# EAGLE schematic FresqueRVB (EAGLE 6.1)
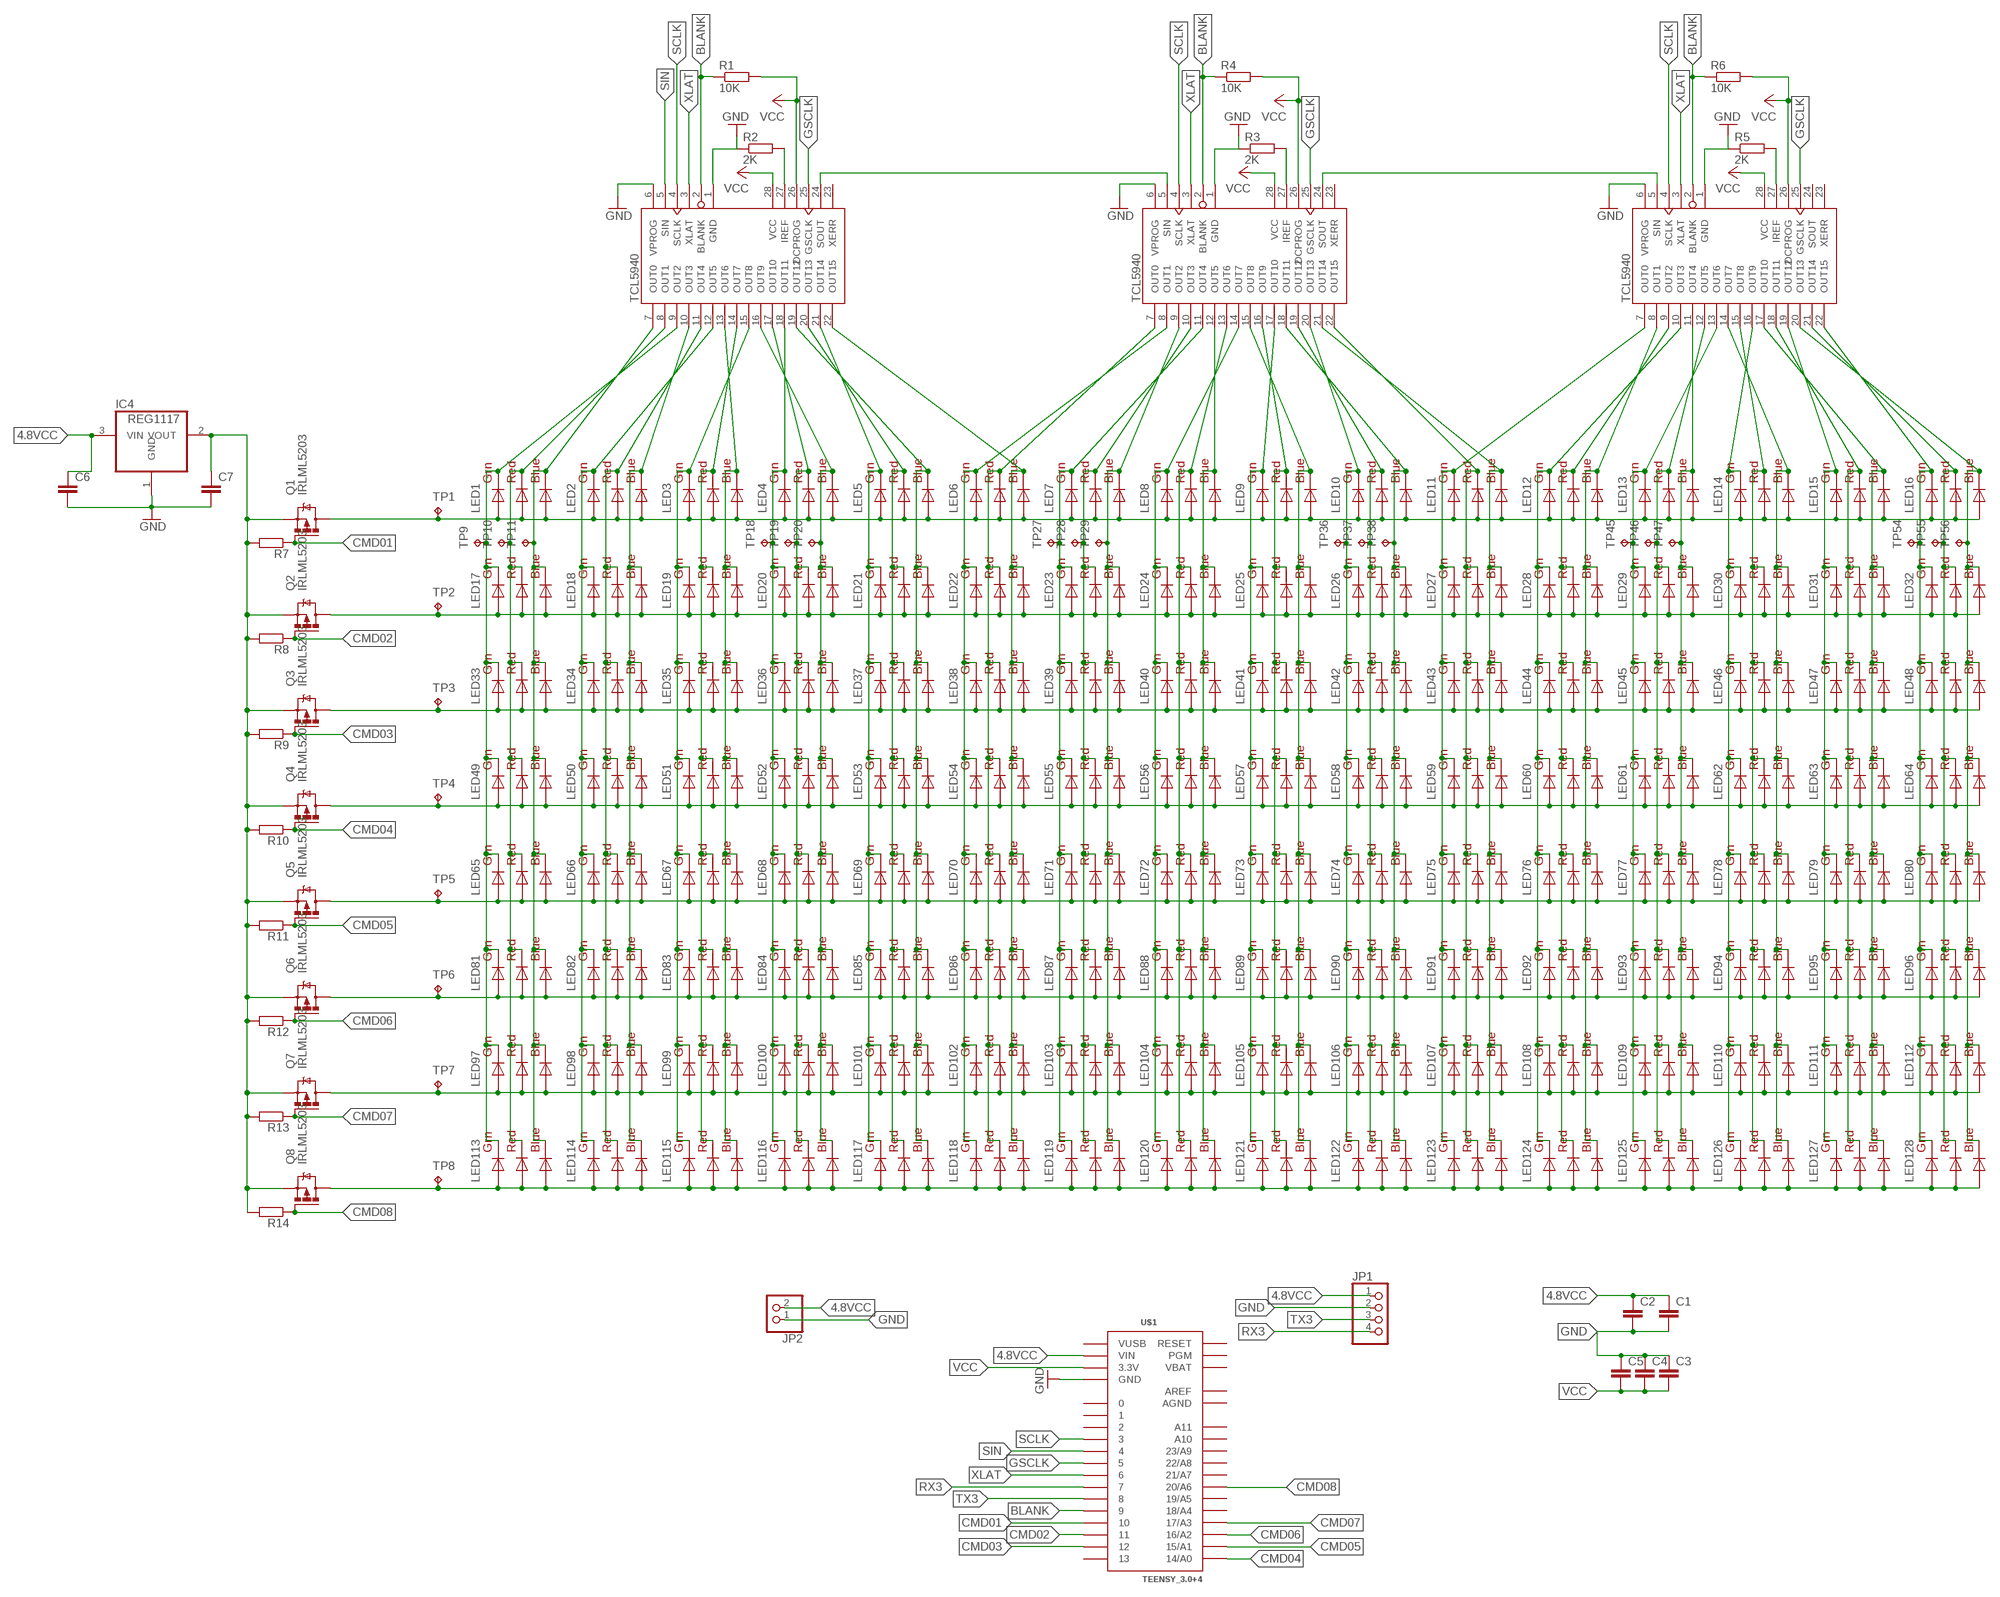
[diagram p0: schematic, sheet 1]

## Parts
C1  C-EUC0603K  [C0603K]
C2  C-EUC0603K  [C0603K]
C3  C-EUC0603K  [C0603K]
C4  C-EUC0603K  [C0603K]
C5  C-EUC0603K  [C0603K]
C6  C-EUC0603K  [C0603K]
C7  C-EUC0603K  [C0603K]
IC1  TCL5940_TCL5940PWP  [TCL5940_PWP]
IC2  TCL5940_TCL5940PWP  [TCL5940_PWP]
IC3  TCL5940_TCL5940PWP  [TCL5940_PWP]
IC4  REG1117  [SOT223]
JP1  PINHD-1X4  [1X04]
JP2  PINHD-1X2  [1X02]
LED1  RGBLED5050  [RGBLED5050]
LED2  RGBLED5050  [RGBLED5050]
LED3  RGBLED5050  [RGBLED5050]
LED4  RGBLED5050  [RGBLED5050]
LED5  RGBLED5050  [RGBLED5050]
LED6  RGBLED5050  [RGBLED5050]
LED7  RGBLED5050  [RGBLED5050]
LED8  RGBLED5050  [RGBLED5050]
LED9  RGBLED5050  [RGBLED5050]
LED10  RGBLED5050  [RGBLED5050]
LED11  RGBLED5050  [RGBLED5050]
LED12  RGBLED5050  [RGBLED5050]
LED13  RGBLED5050  [RGBLED5050]
LED14  RGBLED5050  [RGBLED5050]
LED15  RGBLED5050  [RGBLED5050]
LED16  RGBLED5050  [RGBLED5050]
LED17  RGBLED5050  [RGBLED5050]
LED18  RGBLED5050  [RGBLED5050]
LED19  RGBLED5050  [RGBLED5050]
LED20  RGBLED5050  [RGBLED5050]
LED21  RGBLED5050  [RGBLED5050]
LED22  RGBLED5050  [RGBLED5050]
LED23  RGBLED5050  [RGBLED5050]
LED24  RGBLED5050  [RGBLED5050]
LED25  RGBLED5050  [RGBLED5050]
LED26  RGBLED5050  [RGBLED5050]
LED27  RGBLED5050  [RGBLED5050]
LED28  RGBLED5050  [RGBLED5050]
LED29  RGBLED5050  [RGBLED5050]
LED30  RGBLED5050  [RGBLED5050]
LED31  RGBLED5050  [RGBLED5050]
LED32  RGBLED5050  [RGBLED5050]
LED33  RGBLED5050  [RGBLED5050]
LED34  RGBLED5050  [RGBLED5050]
LED35  RGBLED5050  [RGBLED5050]
LED36  RGBLED5050  [RGBLED5050]
LED37  RGBLED5050  [RGBLED5050]
LED38  RGBLED5050  [RGBLED5050]
LED39  RGBLED5050  [RGBLED5050]
LED40  RGBLED5050  [RGBLED5050]
LED41  RGBLED5050  [RGBLED5050]
LED42  RGBLED5050  [RGBLED5050]
LED43  RGBLED5050  [RGBLED5050]
LED44  RGBLED5050  [RGBLED5050]
LED45  RGBLED5050  [RGBLED5050]
LED46  RGBLED5050  [RGBLED5050]
LED47  RGBLED5050  [RGBLED5050]
LED48  RGBLED5050  [RGBLED5050]
LED49  RGBLED5050  [RGBLED5050]
LED50  RGBLED5050  [RGBLED5050]
LED51  RGBLED5050  [RGBLED5050]
LED52  RGBLED5050  [RGBLED5050]
LED53  RGBLED5050  [RGBLED5050]
LED54  RGBLED5050  [RGBLED5050]
LED55  RGBLED5050  [RGBLED5050]
LED56  RGBLED5050  [RGBLED5050]
LED57  RGBLED5050  [RGBLED5050]
LED58  RGBLED5050  [RGBLED5050]
LED59  RGBLED5050  [RGBLED5050]
LED60  RGBLED5050  [RGBLED5050]
LED61  RGBLED5050  [RGBLED5050]
LED62  RGBLED5050  [RGBLED5050]
LED63  RGBLED5050  [RGBLED5050]
LED64  RGBLED5050  [RGBLED5050]
LED65  RGBLED5050  [RGBLED5050]
LED66  RGBLED5050  [RGBLED5050]
LED67  RGBLED5050  [RGBLED5050]
LED68  RGBLED5050  [RGBLED5050]
LED69  RGBLED5050  [RGBLED5050]
LED70  RGBLED5050  [RGBLED5050]
LED71  RGBLED5050  [RGBLED5050]
LED72  RGBLED5050  [RGBLED5050]
LED73  RGBLED5050  [RGBLED5050]
LED74  RGBLED5050  [RGBLED5050]
LED75  RGBLED5050  [RGBLED5050]
LED76  RGBLED5050  [RGBLED5050]
LED77  RGBLED5050  [RGBLED5050]
LED78  RGBLED5050  [RGBLED5050]
LED79  RGBLED5050  [RGBLED5050]
LED80  RGBLED5050  [RGBLED5050]
LED81  RGBLED5050  [RGBLED5050]
LED82  RGBLED5050  [RGBLED5050]
LED83  RGBLED5050  [RGBLED5050]
LED84  RGBLED5050  [RGBLED5050]
LED85  RGBLED5050  [RGBLED5050]
LED86  RGBLED5050  [RGBLED5050]
LED87  RGBLED5050  [RGBLED5050]
LED88  RGBLED5050  [RGBLED5050]
LED89  RGBLED5050  [RGBLED5050]
LED90  RGBLED5050  [RGBLED5050]
LED91  RGBLED5050  [RGBLED5050]
LED92  RGBLED5050  [RGBLED5050]
LED93  RGBLED5050  [RGBLED5050]
LED94  RGBLED5050  [RGBLED5050]
LED95  RGBLED5050  [RGBLED5050]
LED96  RGBLED5050  [RGBLED5050]
LED97  RGBLED5050  [RGBLED5050]
LED98  RGBLED5050  [RGBLED5050]
LED99  RGBLED5050  [RGBLED5050]
LED100  RGBLED5050  [RGBLED5050]
LED101  RGBLED5050  [RGBLED5050]
LED102  RGBLED5050  [RGBLED5050]
LED103  RGBLED5050  [RGBLED5050]
LED104  RGBLED5050  [RGBLED5050]
LED105  RGBLED5050  [RGBLED5050]
LED106  RGBLED5050  [RGBLED5050]
LED107  RGBLED5050  [RGBLED5050]
LED108  RGBLED5050  [RGBLED5050]
LED109  RGBLED5050  [RGBLED5050]
LED110  RGBLED5050  [RGBLED5050]
LED111  RGBLED5050  [RGBLED5050]
LED112  RGBLED5050  [RGBLED5050]
LED113  RGBLED5050  [RGBLED5050]
LED114  RGBLED5050  [RGBLED5050]
LED115  RGBLED5050  [RGBLED5050]
LED116  RGBLED5050  [RGBLED5050]
LED117  RGBLED5050  [RGBLED5050]
LED118  RGBLED5050  [RGBLED5050]
LED119  RGBLED5050  [RGBLED5050]
LED120  RGBLED5050  [RGBLED5050]
LED121  RGBLED5050  [RGBLED5050]
LED122  RGBLED5050  [RGBLED5050]
LED123  RGBLED5050  [RGBLED5050]
LED124  RGBLED5050  [RGBLED5050]
LED125  RGBLED5050  [RGBLED5050]
LED126  RGBLED5050  [RGBLED5050]
LED127  RGBLED5050  [RGBLED5050]
LED128  RGBLED5050  [RGBLED5050]
Q1  IRLML5203  [MICRO3]
Q2  IRLML5203  [MICRO3]
Q3  IRLML5203  [MICRO3]
Q4  IRLML5203  [MICRO3]
Q5  IRLML5203  [MICRO3]
Q6  IRLML5203  [MICRO3]
Q7  IRLML5203  [MICRO3]
Q8  IRLML5203  [MICRO3]
R1  10K  R-EU_R0603  [R0603]
R2  2K  R-EU_R0603  [R0603]
R3  2K  R-EU_R0603  [R0603]
R4  10K  R-EU_R0603  [R0603]
R5  2K  R-EU_R0603  [R0603]
R6  10K  R-EU_R0603  [R0603]
R7  R-EU_R0603  [R0603]
R8  R-EU_R0603  [R0603]
R9  R-EU_R0603  [R0603]
R10  R-EU_R0603  [R0603]
R11  R-EU_R0603  [R0603]
R12  R-EU_R0603  [R0603]
R13  R-EU_R0603  [R0603]
R14  R-EU_R0603  [R0603]
TP1  TPPAD1-13  [P1-13]
TP2  TPPAD1-13  [P1-13]
TP3  TPPAD1-13  [P1-13]
TP4  TPPAD1-13  [P1-13]
TP5  TPPAD1-13  [P1-13]
TP6  TPPAD1-13  [P1-13]
TP7  TPPAD1-13  [P1-13]
TP8  TPPAD1-13  [P1-13]
TP9  TPPAD1-13  [P1-13]
TP10  TPPAD1-13  [P1-13]
TP11  TPPAD1-13  [P1-13]
TP18  TPPAD1-13  [P1-13]
TP19  TPPAD1-13  [P1-13]
TP20  TPPAD1-13  [P1-13]
TP27  TPPAD1-13  [P1-13]
TP28  TPPAD1-13  [P1-13]
TP29  TPPAD1-13  [P1-13]
TP36  TPPAD1-13  [P1-13]
TP37  TPPAD1-13  [P1-13]
TP38  TPPAD1-13  [P1-13]
TP45  TPPAD1-13  [P1-13]
TP46  TPPAD1-13  [P1-13]
TP47  TPPAD1-13  [P1-13]
TP54  TPPAD1-13  [P1-13]
TP55  TPPAD1-13  [P1-13]
TP56  TPPAD1-13  [P1-13]
U$1  TEENSY_3.0+4  [TEENSY_3.0+4]

## Nets
4.8VCC: C1.1 C2.1 C6.1 IC4.3(VIN) JP1.1 JP2.2 U$1.VIN
BLANK: IC1.2(BLANK) IC2.2(BLANK) IC3.2(BLANK) R1.1 R4.1 R6.1 U$1.9
CMD01: Q1.1(G) R7.1 U$1.10
CMD02: Q2.1(G) R8.1 U$1.11
CMD03: Q3.1(G) R9.1 U$1.12
CMD04: Q4.1(G) R10.1 U$1.14/A0
CMD05: Q5.1(G) R11.1 U$1.15/A1
CMD06: Q6.1(G) R12.1 U$1.16/A2
CMD07: Q7.1(G) R13.1 U$1.17/A3
CMD08: Q8.1(G) R14.1 U$1.20/A6
GND: C1.2 C2.2 C3.1 C4.1 C5.1 C6.2 C7.2 IC1.1(GND) IC1.6(VPROG) IC2.6(VPROG) IC3.1(GND) IC3.6(VPROG) IC4.1(GND) JP1.2 JP2.1 R2.1 R3.1 R5.1 U$1.GND U$1.GND1(GND)
GSCLK: IC1.25(GSCLK) IC2.25(GSCLK) IC3.25(GSCLK) U$1.5
N$1: IC2.27(IREF) R3.2
N$2: IC1.27(IREF) R2.2
N$3: IC3.27(IREF) R5.2
N$4: IC1.9(OUT2) LED1.6(GREEN_C) LED17.6(GREEN_C) LED33.6(GREEN_C) LED49.6(GREEN_C) LED65.6(GREEN_C) LED81.6(GREEN_C) LED97.6(GREEN_C) LED113.6(GREEN_C) TP9.TP
N$5: IC1.8(OUT1) LED1.5(RED_C) LED17.5(RED_C) LED33.5(RED_C) LED49.5(RED_C) LED65.5(RED_C) LED81.5(RED_C) LED97.5(RED_C) LED113.5(RED_C) TP10.TP
N$6: IC1.7(OUT0) LED1.4(BLUE_C) LED17.4(BLUE_C) LED33.4(BLUE_C) LED49.4(BLUE_C) LED65.4(BLUE_C) LED81.4(BLUE_C) LED97.4(BLUE_C) LED113.4(BLUE_C) TP11.TP
N$7: IC1.12(OUT5) LED2.6(GREEN_C) LED18.6(GREEN_C) LED34.6(GREEN_C) LED50.6(GREEN_C) LED66.6(GREEN_C) LED82.6(GREEN_C) LED98.6(GREEN_C) LED114.6(GREEN_C)
N$8: IC1.11(OUT4) LED2.5(RED_C) LED18.5(RED_C) LED34.5(RED_C) LED50.5(RED_C) LED66.5(RED_C) LED82.5(RED_C) LED98.5(RED_C) LED114.5(RED_C)
N$9: IC1.10(OUT3) LED2.4(BLUE_C) LED18.4(BLUE_C) LED34.4(BLUE_C) LED50.4(BLUE_C) LED66.4(BLUE_C) LED82.4(BLUE_C) LED98.4(BLUE_C) LED114.4(BLUE_C)
N$10: IC1.15(OUT8) LED3.6(GREEN_C) LED19.6(GREEN_C) LED35.6(GREEN_C) LED51.6(GREEN_C) LED67.6(GREEN_C) LED83.6(GREEN_C) LED99.6(GREEN_C) LED115.6(GREEN_C)
N$11: IC1.14(OUT7) LED3.5(RED_C) LED19.5(RED_C) LED35.5(RED_C) LED51.5(RED_C) LED67.5(RED_C) LED83.5(RED_C) LED99.5(RED_C) LED115.5(RED_C)
N$12: IC1.13(OUT6) LED3.4(BLUE_C) LED19.4(BLUE_C) LED35.4(BLUE_C) LED51.4(BLUE_C) LED67.4(BLUE_C) LED83.4(BLUE_C) LED99.4(BLUE_C) LED115.4(BLUE_C)
N$13: IC1.18(OUT11) LED4.6(GREEN_C) LED20.6(GREEN_C) LED36.6(GREEN_C) LED52.6(GREEN_C) LED68.6(GREEN_C) LED84.6(GREEN_C) LED100.6(GREEN_C) LED116.6(GREEN_C) TP18.TP
N$14: IC1.17(OUT10) LED4.5(RED_C) LED20.5(RED_C) LED36.5(RED_C) LED52.5(RED_C) LED68.5(RED_C) LED84.5(RED_C) LED100.5(RED_C) LED116.5(RED_C) TP19.TP
N$15: IC1.16(OUT9) LED4.4(BLUE_C) LED20.4(BLUE_C) LED36.4(BLUE_C) LED52.4(BLUE_C) LED68.4(BLUE_C) LED84.4(BLUE_C) LED100.4(BLUE_C) LED116.4(BLUE_C) TP20.TP
N$16: IC1.21(OUT14) LED5.6(GREEN_C) LED21.6(GREEN_C) LED37.6(GREEN_C) LED53.6(GREEN_C) LED69.6(GREEN_C) LED85.6(GREEN_C) LED101.6(GREEN_C) LED117.6(GREEN_C)
N$17: IC1.20(OUT13) LED5.5(RED_C) LED21.5(RED_C) LED37.5(RED_C) LED53.5(RED_C) LED69.5(RED_C) LED85.5(RED_C) LED101.5(RED_C) LED117.5(RED_C)
N$18: IC1.19(OUT12) LED5.4(BLUE_C) LED21.4(BLUE_C) LED37.4(BLUE_C) LED53.4(BLUE_C) LED69.4(BLUE_C) LED85.4(BLUE_C) LED101.4(BLUE_C) LED117.4(BLUE_C)
N$19: IC2.8(OUT1) LED6.6(GREEN_C) LED22.6(GREEN_C) LED38.6(GREEN_C) LED54.6(GREEN_C) LED70.6(GREEN_C) LED86.6(GREEN_C) LED102.6(GREEN_C) LED118.6(GREEN_C)
N$20: IC2.7(OUT0) LED6.5(RED_C) LED22.5(RED_C) LED38.5(RED_C) LED54.5(RED_C) LED70.5(RED_C) LED86.5(RED_C) LED102.5(RED_C) LED118.5(RED_C)
N$21: IC1.22(OUT15) LED6.4(BLUE_C) LED22.4(BLUE_C) LED38.4(BLUE_C) LED54.4(BLUE_C) LED70.4(BLUE_C) LED86.4(BLUE_C) LED102.4(BLUE_C) LED118.4(BLUE_C)
N$22: IC2.11(OUT4) LED7.6(GREEN_C) LED23.6(GREEN_C) LED39.6(GREEN_C) LED55.6(GREEN_C) LED71.6(GREEN_C) LED87.6(GREEN_C) LED103.6(GREEN_C) LED119.6(GREEN_C) TP27.TP
N$23: IC2.10(OUT3) LED7.5(RED_C) LED23.5(RED_C) LED39.5(RED_C) LED55.5(RED_C) LED71.5(RED_C) LED87.5(RED_C) LED103.5(RED_C) LED119.5(RED_C) TP28.TP
N$24: IC2.9(OUT2) LED7.4(BLUE_C) LED23.4(BLUE_C) LED39.4(BLUE_C) LED55.4(BLUE_C) LED71.4(BLUE_C) LED87.4(BLUE_C) LED103.4(BLUE_C) LED119.4(BLUE_C) TP29.TP
N$25: IC2.14(OUT7) LED8.6(GREEN_C) LED24.6(GREEN_C) LED40.6(GREEN_C) LED56.6(GREEN_C) LED72.6(GREEN_C) LED88.6(GREEN_C) LED104.6(GREEN_C) LED120.6(GREEN_C)
N$26: IC2.13(OUT6) LED8.5(RED_C) LED24.5(RED_C) LED40.5(RED_C) LED56.5(RED_C) LED72.5(RED_C) LED88.5(RED_C) LED104.5(RED_C) LED120.5(RED_C)
N$27: IC2.12(OUT5) LED8.4(BLUE_C) LED24.4(BLUE_C) LED40.4(BLUE_C) LED56.4(BLUE_C) LED72.4(BLUE_C) LED88.4(BLUE_C) LED104.4(BLUE_C) LED120.4(BLUE_C)
N$28: IC2.17(OUT10) LED9.6(GREEN_C) LED25.6(GREEN_C) LED41.6(GREEN_C) LED57.6(GREEN_C) LED73.6(GREEN_C) LED89.6(GREEN_C) LED105.6(GREEN_C) LED121.6(GREEN_C)
N$29: IC2.16(OUT9) LED9.5(RED_C) LED25.5(RED_C) LED41.5(RED_C) LED57.5(RED_C) LED73.5(RED_C) LED89.5(RED_C) LED105.5(RED_C) LED121.5(RED_C)
N$30: IC2.15(OUT8) LED9.4(BLUE_C) LED25.4(BLUE_C) LED41.4(BLUE_C) LED57.4(BLUE_C) LED73.4(BLUE_C) LED89.4(BLUE_C) LED105.4(BLUE_C) LED121.4(BLUE_C)
N$31: IC2.20(OUT13) LED10.6(GREEN_C) LED26.6(GREEN_C) LED42.6(GREEN_C) LED58.6(GREEN_C) LED74.6(GREEN_C) LED90.6(GREEN_C) LED106.6(GREEN_C) LED122.6(GREEN_C) TP36.TP
N$32: IC2.19(OUT12) LED10.5(RED_C) LED26.5(RED_C) LED42.5(RED_C) LED58.5(RED_C) LED74.5(RED_C) LED90.5(RED_C) LED106.5(RED_C) LED122.5(RED_C) TP37.TP
N$33: IC2.18(OUT11) LED10.4(BLUE_C) LED26.4(BLUE_C) LED42.4(BLUE_C) LED58.4(BLUE_C) LED74.4(BLUE_C) LED90.4(BLUE_C) LED106.4(BLUE_C) LED122.4(BLUE_C) TP38.TP
N$34: IC3.7(OUT0) LED11.6(GREEN_C) LED27.6(GREEN_C) LED43.6(GREEN_C) LED59.6(GREEN_C) LED75.6(GREEN_C) LED91.6(GREEN_C) LED107.6(GREEN_C) LED123.6(GREEN_C)
N$35: IC2.22(OUT15) LED11.5(RED_C) LED27.5(RED_C) LED43.5(RED_C) LED59.5(RED_C) LED75.5(RED_C) LED91.5(RED_C) LED107.5(RED_C) LED123.5(RED_C)
N$36: IC2.21(OUT14) LED11.4(BLUE_C) LED27.4(BLUE_C) LED43.4(BLUE_C) LED59.4(BLUE_C) LED75.4(BLUE_C) LED91.4(BLUE_C) LED107.4(BLUE_C) LED123.4(BLUE_C)
N$37: IC3.10(OUT3) LED12.6(GREEN_C) LED28.6(GREEN_C) LED44.6(GREEN_C) LED60.6(GREEN_C) LED76.6(GREEN_C) LED92.6(GREEN_C) LED108.6(GREEN_C) LED124.6(GREEN_C)
N$38: IC3.9(OUT2) LED12.5(RED_C) LED28.5(RED_C) LED44.5(RED_C) LED60.5(RED_C) LED76.5(RED_C) LED92.5(RED_C) LED108.5(RED_C) LED124.5(RED_C)
N$39: IC3.8(OUT1) LED12.4(BLUE_C) LED28.4(BLUE_C) LED44.4(BLUE_C) LED60.4(BLUE_C) LED76.4(BLUE_C) LED92.4(BLUE_C) LED108.4(BLUE_C) LED124.4(BLUE_C)
N$40: IC3.13(OUT6) LED13.6(GREEN_C) LED29.6(GREEN_C) LED45.6(GREEN_C) LED61.6(GREEN_C) LED77.6(GREEN_C) LED93.6(GREEN_C) LED109.6(GREEN_C) LED125.6(GREEN_C) TP45.TP
N$41: IC3.12(OUT5) LED13.5(RED_C) LED29.5(RED_C) LED45.5(RED_C) LED61.5(RED_C) LED77.5(RED_C) LED93.5(RED_C) LED109.5(RED_C) LED125.5(RED_C) TP46.TP
N$42: IC3.11(OUT4) LED13.4(BLUE_C) LED29.4(BLUE_C) LED45.4(BLUE_C) LED61.4(BLUE_C) LED77.4(BLUE_C) LED93.4(BLUE_C) LED109.4(BLUE_C) LED125.4(BLUE_C) TP47.TP
N$43: IC3.16(OUT9) LED14.6(GREEN_C) LED30.6(GREEN_C) LED46.6(GREEN_C) LED62.6(GREEN_C) LED78.6(GREEN_C) LED94.6(GREEN_C) LED110.6(GREEN_C) LED126.6(GREEN_C)
N$44: IC3.15(OUT8) LED14.5(RED_C) LED30.5(RED_C) LED46.5(RED_C) LED62.5(RED_C) LED78.5(RED_C) LED94.5(RED_C) LED110.5(RED_C) LED126.5(RED_C)
N$45: IC3.14(OUT7) LED14.4(BLUE_C) LED30.4(BLUE_C) LED46.4(BLUE_C) LED62.4(BLUE_C) LED78.4(BLUE_C) LED94.4(BLUE_C) LED110.4(BLUE_C) LED126.4(BLUE_C)
N$46: IC3.19(OUT12) LED15.6(GREEN_C) LED31.6(GREEN_C) LED47.6(GREEN_C) LED63.6(GREEN_C) LED79.6(GREEN_C) LED95.6(GREEN_C) LED111.6(GREEN_C) LED127.6(GREEN_C)
N$47: IC3.18(OUT11) LED15.5(RED_C) LED31.5(RED_C) LED47.5(RED_C) LED63.5(RED_C) LED79.5(RED_C) LED95.5(RED_C) LED111.5(RED_C) LED127.5(RED_C)
N$48: IC3.17(OUT10) LED15.4(BLUE_C) LED31.4(BLUE_C) LED47.4(BLUE_C) LED63.4(BLUE_C) LED79.4(BLUE_C) LED95.4(BLUE_C) LED111.4(BLUE_C) LED127.4(BLUE_C)
N$49: IC3.22(OUT15) LED16.6(GREEN_C) LED32.6(GREEN_C) LED48.6(GREEN_C) LED64.6(GREEN_C) LED80.6(GREEN_C) LED96.6(GREEN_C) LED112.6(GREEN_C) LED128.6(GREEN_C) TP54.TP
N$50: IC3.21(OUT14) LED16.5(RED_C) LED32.5(RED_C) LED48.5(RED_C) LED64.5(RED_C) LED80.5(RED_C) LED96.5(RED_C) LED112.5(RED_C) LED128.5(RED_C) TP55.TP
N$51: IC3.20(OUT13) LED16.4(BLUE_C) LED32.4(BLUE_C) LED48.4(BLUE_C) LED64.4(BLUE_C) LED80.4(BLUE_C) LED96.4(BLUE_C) LED112.4(BLUE_C) LED128.4(BLUE_C) TP56.TP
N$52: IC1.24(SOUT) IC2.5(SIN)
N$53: IC2.24(SOUT) IC3.5(SIN)
N$54: LED1.1(GREEN_A) LED1.2(RED_A) LED1.3(BLUE_A) LED2.1(GREEN_A) LED2.2(RED_A) LED2.3(BLUE_A) LED3.1(GREEN_A) LED3.2(RED_A) LED3.3(BLUE_A) LED4.1(GREEN_A) LED4.2(RED_A) LED4.3(BLUE_A) LED5.1(GREEN_A) LED5.2(RED_A) LED5.3(BLUE_A) LED6.1(GREEN_A) LED6.2(RED_A) LED6.3(BLUE_A) LED7.1(GREEN_A) LED7.2(RED_A) LED7.3(BLUE_A) LED8.1(GREEN_A) LED8.2(RED_A) LED8.3(BLUE_A) LED9.1(GREEN_A) LED9.2(RED_A) LED9.3(BLUE_A) LED10.1(GREEN_A) LED10.2(RED_A) LED10.3(BLUE_A) LED11.1(GREEN_A) LED11.2(RED_A) LED11.3(BLUE_A) LED12.1(GREEN_A) LED12.2(RED_A) LED12.3(BLUE_A) LED13.1(GREEN_A) LED13.2(RED_A) LED13.3(BLUE_A) LED14.1(GREEN_A) LED14.2(RED_A) LED14.3(BLUE_A) LED15.1(GREEN_A) LED15.2(RED_A) LED15.3(BLUE_A) LED16.1(GREEN_A) LED16.2(RED_A) LED16.3(BLUE_A) Q1.3(D) TP1.TP
N$55: LED17.1(GREEN_A) LED17.2(RED_A) LED17.3(BLUE_A) LED18.1(GREEN_A) LED18.2(RED_A) LED18.3(BLUE_A) LED19.1(GREEN_A) LED19.2(RED_A) LED19.3(BLUE_A) LED20.1(GREEN_A) LED20.2(RED_A) LED20.3(BLUE_A) LED21.1(GREEN_A) LED21.2(RED_A) LED21.3(BLUE_A) LED22.1(GREEN_A) LED22.2(RED_A) LED22.3(BLUE_A) LED23.1(GREEN_A) LED23.2(RED_A) LED23.3(BLUE_A) LED24.1(GREEN_A) LED24.2(RED_A) LED24.3(BLUE_A) LED25.1(GREEN_A) LED25.2(RED_A) LED25.3(BLUE_A) LED26.1(GREEN_A) LED26.2(RED_A) LED26.3(BLUE_A) LED27.1(GREEN_A) LED27.2(RED_A) LED27.3(BLUE_A) LED28.1(GREEN_A) LED28.2(RED_A) LED28.3(BLUE_A) LED29.1(GREEN_A) LED29.2(RED_A) LED29.3(BLUE_A) LED30.1(GREEN_A) LED30.2(RED_A) LED30.3(BLUE_A) LED31.1(GREEN_A) LED31.2(RED_A) LED31.3(BLUE_A) LED32.1(GREEN_A) LED32.2(RED_A) LED32.3(BLUE_A) Q2.3(D) TP2.TP
N$63: C7.1 IC4.2(VOUT) Q1.2(S) Q2.2(S) Q3.2(S) Q4.2(S) Q5.2(S) Q6.2(S) Q7.2(S) Q8.2(S) R7.2 R8.2 R9.2 R10.2 R11.2 R12.2 R13.2 R14.2
N$104: LED33.1(GREEN_A) LED33.2(RED_A) LED33.3(BLUE_A) LED34.1(GREEN_A) LED34.2(RED_A) LED34.3(BLUE_A) LED35.1(GREEN_A) LED35.2(RED_A) LED35.3(BLUE_A) LED36.1(GREEN_A) LED36.2(RED_A) LED36.3(BLUE_A) LED37.1(GREEN_A) LED37.2(RED_A) LED37.3(BLUE_A) LED38.1(GREEN_A) LED38.2(RED_A) LED38.3(BLUE_A) LED39.1(GREEN_A) LED39.2(RED_A) LED39.3(BLUE_A) LED40.1(GREEN_A) LED40.2(RED_A) LED40.3(BLUE_A) LED41.1(GREEN_A) LED41.2(RED_A) LED41.3(BLUE_A) LED42.1(GREEN_A) LED42.2(RED_A) LED42.3(BLUE_A) LED43.1(GREEN_A) LED43.2(RED_A) LED43.3(BLUE_A) LED44.1(GREEN_A) LED44.2(RED_A) LED44.3(BLUE_A) LED45.1(GREEN_A) LED45.2(RED_A) LED45.3(BLUE_A) LED46.1(GREEN_A) LED46.2(RED_A) LED46.3(BLUE_A) LED47.1(GREEN_A) LED47.2(RED_A) LED47.3(BLUE_A) LED48.1(GREEN_A) LED48.2(RED_A) LED48.3(BLUE_A) Q3.3(D) TP3.TP
N$105: LED49.1(GREEN_A) LED49.2(RED_A) LED49.3(BLUE_A) LED50.1(GREEN_A) LED50.2(RED_A) LED50.3(BLUE_A) LED51.1(GREEN_A) LED51.2(RED_A) LED51.3(BLUE_A) LED52.1(GREEN_A) LED52.2(RED_A) LED52.3(BLUE_A) LED53.1(GREEN_A) LED53.2(RED_A) LED53.3(BLUE_A) LED54.1(GREEN_A) LED54.2(RED_A) LED54.3(BLUE_A) LED55.1(GREEN_A) LED55.2(RED_A) LED55.3(BLUE_A) LED56.1(GREEN_A) LED56.2(RED_A) LED56.3(BLUE_A) LED57.1(GREEN_A) LED57.2(RED_A) LED57.3(BLUE_A) LED58.1(GREEN_A) LED58.2(RED_A) LED58.3(BLUE_A) LED59.1(GREEN_A) LED59.2(RED_A) LED59.3(BLUE_A) LED60.1(GREEN_A) LED60.2(RED_A) LED60.3(BLUE_A) LED61.1(GREEN_A) LED61.2(RED_A) LED61.3(BLUE_A) LED62.1(GREEN_A) LED62.2(RED_A) LED62.3(BLUE_A) LED63.1(GREEN_A) LED63.2(RED_A) LED63.3(BLUE_A) LED64.1(GREEN_A) LED64.2(RED_A) LED64.3(BLUE_A) Q4.3(D) TP4.TP
N$154: LED65.1(GREEN_A) LED65.2(RED_A) LED65.3(BLUE_A) LED66.1(GREEN_A) LED66.2(RED_A) LED66.3(BLUE_A) LED67.1(GREEN_A) LED67.2(RED_A) LED67.3(BLUE_A) LED68.1(GREEN_A) LED68.2(RED_A) LED68.3(BLUE_A) LED69.1(GREEN_A) LED69.2(RED_A) LED69.3(BLUE_A) LED70.1(GREEN_A) LED70.2(RED_A) LED70.3(BLUE_A) LED71.1(GREEN_A) LED71.2(RED_A) LED71.3(BLUE_A) LED72.1(GREEN_A) LED72.2(RED_A) LED72.3(BLUE_A) LED73.1(GREEN_A) LED73.2(RED_A) LED73.3(BLUE_A) LED74.1(GREEN_A) LED74.2(RED_A) LED74.3(BLUE_A) LED75.1(GREEN_A) LED75.2(RED_A) LED75.3(BLUE_A) LED76.1(GREEN_A) LED76.2(RED_A) LED76.3(BLUE_A) LED77.1(GREEN_A) LED77.2(RED_A) LED77.3(BLUE_A) LED78.1(GREEN_A) LED78.2(RED_A) LED78.3(BLUE_A) LED79.1(GREEN_A) LED79.2(RED_A) LED79.3(BLUE_A) LED80.1(GREEN_A) LED80.2(RED_A) LED80.3(BLUE_A) Q5.3(D) TP5.TP
N$203: LED81.1(GREEN_A) LED81.2(RED_A) LED81.3(BLUE_A) LED82.1(GREEN_A) LED82.2(RED_A) LED82.3(BLUE_A) LED83.1(GREEN_A) LED83.2(RED_A) LED83.3(BLUE_A) LED84.1(GREEN_A) LED84.2(RED_A) LED84.3(BLUE_A) LED85.1(GREEN_A) LED85.2(RED_A) LED85.3(BLUE_A) LED86.1(GREEN_A) LED86.2(RED_A) LED86.3(BLUE_A) LED87.1(GREEN_A) LED87.2(RED_A) LED87.3(BLUE_A) LED88.1(GREEN_A) LED88.2(RED_A) LED88.3(BLUE_A) LED89.1(GREEN_A) LED89.2(RED_A) LED89.3(BLUE_A) LED90.1(GREEN_A) LED90.2(RED_A) LED90.3(BLUE_A) LED91.1(GREEN_A) LED91.2(RED_A) LED91.3(BLUE_A) LED92.1(GREEN_A) LED92.2(RED_A) LED92.3(BLUE_A) LED93.1(GREEN_A) LED93.2(RED_A) LED93.3(BLUE_A) LED94.1(GREEN_A) LED94.2(RED_A) LED94.3(BLUE_A) LED95.1(GREEN_A) LED95.2(RED_A) LED95.3(BLUE_A) LED96.1(GREEN_A) LED96.2(RED_A) LED96.3(BLUE_A) Q6.3(D) TP6.TP
N$252: LED97.1(GREEN_A) LED97.2(RED_A) LED97.3(BLUE_A) LED98.1(GREEN_A) LED98.2(RED_A) LED98.3(BLUE_A) LED99.1(GREEN_A) LED99.2(RED_A) LED99.3(BLUE_A) LED100.1(GREEN_A) LED100.2(RED_A) LED100.3(BLUE_A) LED101.1(GREEN_A) LED101.2(RED_A) LED101.3(BLUE_A) LED102.1(GREEN_A) LED102.2(RED_A) LED102.3(BLUE_A) LED103.1(GREEN_A) LED103.2(RED_A) LED103.3(BLUE_A) LED104.1(GREEN_A) LED104.2(RED_A) LED104.3(BLUE_A) LED105.1(GREEN_A) LED105.2(RED_A) LED105.3(BLUE_A) LED106.1(GREEN_A) LED106.2(RED_A) LED106.3(BLUE_A) LED107.1(GREEN_A) LED107.2(RED_A) LED107.3(BLUE_A) LED108.1(GREEN_A) LED108.2(RED_A) LED108.3(BLUE_A) LED109.1(GREEN_A) LED109.2(RED_A) LED109.3(BLUE_A) LED110.1(GREEN_A) LED110.2(RED_A) LED110.3(BLUE_A) LED111.1(GREEN_A) LED111.2(RED_A) LED111.3(BLUE_A) LED112.1(GREEN_A) LED112.2(RED_A) LED112.3(BLUE_A) Q7.3(D) TP7.TP
N$301: LED113.1(GREEN_A) LED113.2(RED_A) LED113.3(BLUE_A) LED114.1(GREEN_A) LED114.2(RED_A) LED114.3(BLUE_A) LED115.1(GREEN_A) LED115.2(RED_A) LED115.3(BLUE_A) LED116.1(GREEN_A) LED116.2(RED_A) LED116.3(BLUE_A) LED117.1(GREEN_A) LED117.2(RED_A) LED117.3(BLUE_A) LED118.1(GREEN_A) LED118.2(RED_A) LED118.3(BLUE_A) LED119.1(GREEN_A) LED119.2(RED_A) LED119.3(BLUE_A) LED120.1(GREEN_A) LED120.2(RED_A) LED120.3(BLUE_A) LED121.1(GREEN_A) LED121.2(RED_A) LED121.3(BLUE_A) LED122.1(GREEN_A) LED122.2(RED_A) LED122.3(BLUE_A) LED123.1(GREEN_A) LED123.2(RED_A) LED123.3(BLUE_A) LED124.1(GREEN_A) LED124.2(RED_A) LED124.3(BLUE_A) LED125.1(GREEN_A) LED125.2(RED_A) LED125.3(BLUE_A) LED126.1(GREEN_A) LED126.2(RED_A) LED126.3(BLUE_A) LED127.1(GREEN_A) LED127.2(RED_A) LED127.3(BLUE_A) LED128.1(GREEN_A) LED128.2(RED_A) LED128.3(BLUE_A) Q8.3(D) TP8.TP
RX3: JP1.4 U$1.7
SCLK: IC1.4(SCLK) IC2.4(SCLK) IC3.4(SCLK) U$1.3
SIN: IC1.5(SIN) U$1.4
TX3: JP1.3 U$1.8
VCC: C3.2 C4.2 C5.2 IC1.26(DCPROG) IC1.28(VCC) IC2.26(DCPROG) IC2.28(VCC) IC3.26(DCPROG) IC3.28(VCC) R1.2 R4.2 R6.2 U$1.3.3V U$1.3.3V1(3.3V)
XLAT: IC1.3(XLAT) IC2.3(XLAT) IC3.3(XLAT) U$1.6
Unconnected: IC1.23(XERR) IC2.23(XERR) IC3.23(XERR) IC3.24(SOUT) U$1.0 U$1.1 U$1.2 U$1.13 U$1.18/A4 U$1.19/A5 U$1.21/A7 U$1.22/A8 U$1.23/A9 U$1.A10 U$1.A11 U$1.PGM U$1.RESET

## Power pins joined to a net without a drawn wire
4.8VCC: U$1.VBAT
AGND: U$1.AGND
AREF: U$1.AREF
GND: IC2.1(GND)
VUSB: U$1.VUSB

## Library data of the parts
C1-C7 = rcl:C-EU: CAPACITOR, European symbol
IC1-IC3 = matrice-rvb:TCL5940_TCL5940: 16-Channel 12-Bit LED Driver
IC4 = burr-brown:REG1117: 800mA and 1A Low Dropout (LDO) Positive Regulator 1.8V, 2.5V, 2.85V, 3.3V, 5V, and Adj; MPN: REG1117; OC_FARNELL: 1097566; OC_NEWARK: 14P6981
JP1 = pinhead:PINHD-1X4: PIN HEADER
JP2 = pinhead:PINHD-1X2: PIN HEADER
LED1-LED128 = adafruit:RGBLED: For 5050 RGB LEDs, the order of the LEDs may vary from one manufacturer to another!
Q1-Q8 = transistor-power:IRLML5203: HEXFET P-Channel Power MOSFET
R1-R14 = rcl:R-EU_: RESISTOR, European symbol
TP1-TP11 TP18-TP20 TP27-TP29 TP36-TP38 TP45-TP47 TP54-TP56 = testpad:TP: Test pad
U$1 = Teensy3.0:TEENSY_3.0+4: Teensy 3.0 board, showing all pins that are easily acessible. See 'AllAnalogPins" and 'AllPins' packages for additional pin holes, as needed. The 'Basic' package has fewer pins.